# EAGLE design tube timbre trasher 1-9-22-fix (EAGLE 9.6.2)
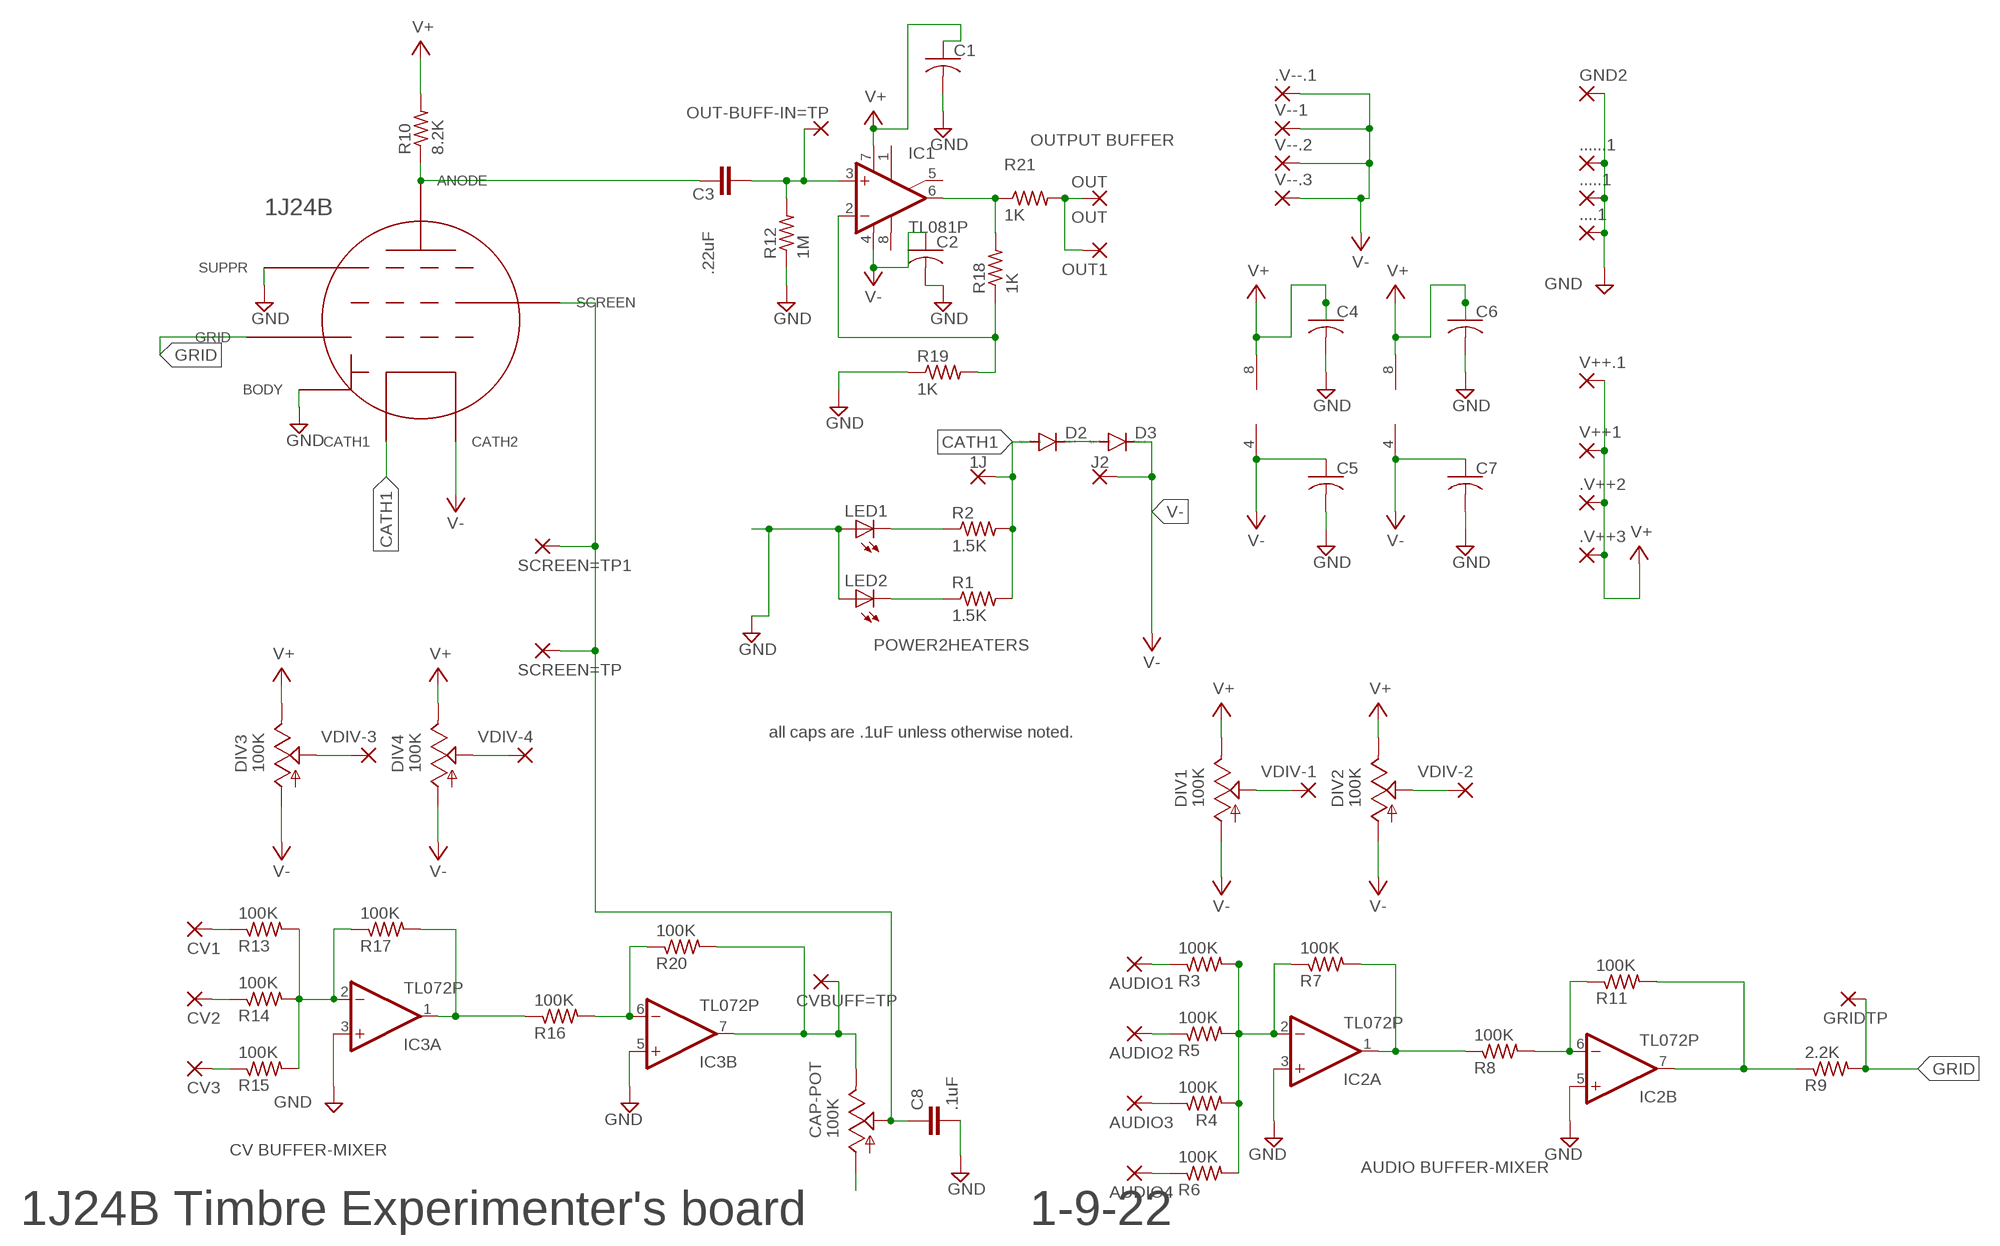
[diagram p0: schematic, sheet 1]

## Parts
1J  1  WIREPAD1,6/0,9  [1,6/0,9]
1J24B  1J24B  [6PINSOLDER]
....1  3,17/1,3  [3,17/1,3]
.....1  3,17/1,3  [3,17/1,3]
......1  3,17/1,3  [3,17/1,3]
.V++2  2,54/1,0  [2,54/1,0]
.V++3  2,54/1,0  [2,54/1,0]
.V--.1  3,17/1,3  [3,17/1,3]
AUDIO1  3,17/1,3  [3,17/1,3]
AUDIO2  3,17/1,3  [3,17/1,3]
AUDIO3  3,17/1,3  [3,17/1,3]
AUDIO4  3,17/1,3  [3,17/1,3]
C1  C-US025-025X050  [C025-025X050]
C2  C-US025-025X050  [C025-025X050]
C3  .22uF  C5/3.5  [C5B3.5]
C4  C-US025-030X050  [C025-030X050]
C5  C-US025-025X050  [C025-025X050]
C6  C-US025-025X050  [C025-025X050]
C7  C-US025-025X050  [C025-025X050]
C8  .1uF  C5/2.5  [C5B2.5]
CAP-POT  100K  9MM_SNAP-IN_POT_  [9MM_SNAP-IN_POT]
CV1  3,17/1,3  [3,17/1,3]
CV2  3,17/1,3  [3,17/1,3]
CV3  3,17/1,3  [3,17/1,3]
CVBUFF=TP  3,17/1,3  [3,17/1,3]
D2  1N4148DO35-7  [DO35-7]
D3  1N4148DO35-7  [DO35-7]
DIV1  100K  9MM_SNAP-IN_POT_  [9MM_SNAP-IN_POT]
DIV2  100K  9MM_SNAP-IN_POT_  [9MM_SNAP-IN_POT]
DIV3  100K  9MM_SNAP-IN_POT_  [9MM_SNAP-IN_POT]
DIV4  100K  9MM_SNAP-IN_POT_  [9MM_SNAP-IN_POT]
GND2  3,17/1,3  [3,17/1,3]
GRIDTP  3,17/1,3  [3,17/1,3]
IC1  TL081P  [DIL08]
IC2  TL072P  [DIL08]
IC3  TL072P  [DIL08]
J2  1  WIREPAD1,6/0,9  [1,6/0,9]
LED1  LED3MM  [LED3MM]
LED2  LED3MM  [LED3MM]
OUT  OUT  3,17/1,3  [3,17/1,3]
OUT1  3,17/1,3  [3,17/1,3]
OUT-BUFF-IN=TP  3,17/1,3  [3,17/1,3]
R1  1.5K  R-US_0207/10  [0207/10]
R2  1.5K  R-US_0207/10  [0207/10]
R3  100K  R-US_0204/7  [0204/7]
R4  100K  R-US_0204/7  [0204/7]
R5  100K  R-US_0204/7  [0204/7]
R6  100K  R-US_0204/7  [0204/7]
R7  100K  R-US_0204/7  [0204/7]
R8  100K  R-US_0204/7  [0204/7]
R9  2.2K  R-US_0204/7  [0204/7]
R10  8.2K  R-US_0207/15  [0207/15]
R11  100K  R-US_0204/7  [0204/7]
R12  1M  R-US_0204/7  [0204/7]
R13  100K  R-US_0204/7  [0204/7]
R14  100K  R-US_0204/7  [0204/7]
R15  100K  R-US_0204/7  [0204/7]
R16  100K  R-US_0204/7  [0204/7]
R17  100K  R-US_0204/7  [0204/7]
R18  1K  R-US_0204/7  [0204/7]
R19  1K  R-US_0204/7  [0204/7]
R20  100K  R-US_0204/7  [0204/7]
R21  1K  R-US_0204/7  [0204/7]
SCREEN=TP  3,17/1,3  [3,17/1,3]
SCREEN=TP1  3,17/1,3  [3,17/1,3]
V++1  2,54/1,0  [2,54/1,0]
V++.1  2,54/1,0  [2,54/1,0]
V--1  3,17/1,3  [3,17/1,3]
V--.2  3,17/1,3  [3,17/1,3]
V--.3  3,17/1,3  [3,17/1,3]
VDIV-1  3,17/1,3  [3,17/1,3]
VDIV-2  3,17/1,3  [3,17/1,3]
VDIV-3  3,17/1,3  [3,17/1,3]
VDIV-4  3,17/1,3  [3,17/1,3]

## Nets
CATH1: 1J24B.1-CATH(CATH1) 1J.1(P) D2.A R1.2 R2.2
GND: 1J24B.3-BDY(BODY) 1J24B.4-SUPP(SUPPR) ....1.1(P) .....1.1(P) ......1.1(P) C1.2 C2.2 C4.2 C5.2 C6.2 C7.2 C8.2 GND2.1(P) IC2.3(A:+IN) IC2.5(B:+IN) IC3.3(A:+IN) IC3.5(B:+IN) LED1.A LED2.A R12.1 R19.1
GRID: 1J24B.6-GRID(GRID) GRIDTP.1(P) R9.2
N$1: 1J24B.A(ANODE) C3.1 R10.1
N$2: C3.2 IC1.3(+IN) OUT-BUFF-IN=TP.1(P) R12.2
N$3: LED2.K(C) R1.1
N$4: IC1.6(OUT) R18.2 R21.1
N$5: LED1.K(C) R2.1
N$6: AUDIO1.1(P) R3.1
N$7: DIV1.2(S) VDIV-1.1(P)
N$8: DIV2.2(S) VDIV-2.1(P)
N$9: D2.C D3.A
N$10: AUDIO3.1(P) R4.1
N$11: IC2.6(B:-IN) R8.2 R11.1
N$12: IC3.6(B:-IN) R16.2 R20.1
N$13: IC2.7(B:OUT) R9.1 R11.2
N$14: AUDIO2.1(P) R5.1
N$15: IC2.2(A:-IN) R3.2 R4.2 R5.2 R6.2 R7.1
N$16: IC2.1(A:OUT) R7.2 R8.1
N$17: CAP-POT.3(E) CVBUFF=TP.1(P) IC3.7(B:OUT) R20.2
N$18: IC1.2(-IN) R18.1 R19.2
N$19: OUT1.1(P) OUT.1(P) R21.2
N$20: CV2.1(P) R14.1
N$21: IC3.2(A:-IN) R13.2 R14.2 R15.2 R17.1
N$22: IC3.1(A:OUT) R16.1 R17.2
N$23: CV1.1(P) R13.1
N$24: DIV3.2(S) VDIV-3.1(P)
N$25: DIV4.2(S) VDIV-4.1(P)
N$26: CV3.1(P) R15.1
N$27: CAP-POT.1(A)
N$28: AUDIO4.1(P) R6.1
TIE: 1J24B.5-SCR(SCREEN) C8.1 CAP-POT.2(S) SCREEN=TP1.1(P) SCREEN=TP.1(P)
V+: .V++2.1(P) .V++3.1(P) C1.1 C4.1 C6.1 DIV1.3(E) DIV2.3(E) DIV3.3(E) DIV4.3(E) IC1.7(V+) IC2.8(P:V+) IC3.8(P:V+) R10.2 V++1.1(P) V++.1.1(P)
V-: 1J24B.2-CATH(CATH2) .V--.1.1(P) C2.1 C5.1 C7.1 D3.C DIV1.1(A) DIV2.1(A) DIV3.1(A) DIV4.1(A) IC1.4(V-) IC2.4(P:V-) IC3.4(P:V-) J2.1(P) V--1.1(P) V--.2.1(P) V--.3.1(P)
Unconnected: IC1.1(ON1) IC1.5(ON2) IC1.8(OPT)

## Notes on the sheet
- OUTPUT BUFFER
- POWER2HEATERS
- all caps are .1uF unless otherwise noted.
- CV BUFFER-MIXER
- AUDIO BUFFER-MIXER
- 1J24B Timbre Experimenter's board | 1-9-22

## Library data of the parts
1J J2 = wirepad:WIREPAD: Wire PAD connect wire on PCB; SPICEPREFIX: X
1J24B = submini tubes CL:1J24B; SPICEPREFIX: X
....1 .....1 ......1 GND2 = wirepad:3,17/1,3: THROUGH-HOLE PAD
.V++2 .V++3 V++1 V++.1 = wirepad-NONAMES:2,54/1,0: THROUGH-HOLE PAD
.V--.1 V--1 V--.2 V--.3 = wirepad-NONAMES:3,17/1,3: THROUGH-HOLE PAD
AUDIO1-AUDIO4 CV1-CV3 CVBUFF=TP GRIDTP OUT OUT1 OUT-BUFF-IN=TP SCREEN=TP SCREEN=TP1 VDIV-1-VDIV-4 = wirepad:3,17/1,3: THROUGH-HOLE PAD; SPICEPREFIX: X
C1 C2 C4-C7 = rcl:C-US: CAPACITOR, American symbol; SPICEPREFIX: C
C3 C8 = capacitor-wima:C: CAPACITOR naming: grid - package width; SPICEPREFIX: C
CAP-POT DIV1-DIV4 = MusicThingModular-CL:9MM_SNAP-IN_POT: 9mm vertical snap-in pot, Alpha / Panasonic style; SPICEPREFIX: J
D2 D3 = diode:1N4148: DIODE high speed (Philips); SPICEPREFIX: D
IC1 = linear:TL081: OP AMP; SPICEPREFIX: X
IC2 IC3 = linear:TL072: OP AMP; SPICEPREFIX: B
LED1 LED2 = adafruit:LED: LED OSRAM: - CHIPLED LG R971, LG N971, LY N971, LG Q971, LY Q971, LO R971, LY R971 LH N974, LH R974 LS Q976, LO Q976, LY Q976 LO Q996 - Hyper CHIPLED LW Q18S LB Q993, LB Q99A, LB R99A - SideLED LS A670, LO A670, LY A670, LG A670, LP A670 LB A673, LV A673, LT A673, LW A673 LH A674 LY A675 LS A676, LA A676, LO A676, LY A676, LW A676 LS A679, LY A679, LG A679 - Hyper Micro SIDELED® LS Y876, LA Y876, LO Y876, LY Y876 LT Y87S - SmartLED LW L88C, LW L88S LB L89C, LB L89S, LG L890 LS L89K, LO L89K, LY L89K LS L896, LA L896, LO L896, LY L896 - TOPLED LS T670, LO T670, LY T670, LG T670, LP T670 LSG T670, LSP T670, LSY T670, LOP T670, LYG T670 LG T671, LOG T671, LSG T671 LB T673, LV T673, LT T673, LW T673 LH T674 LS T676, LA T676, LO T676, LY T676, LB T676, LH T676, LSB T676, LW T676 LB T67C, LV T67C, LT T67C, LS T67K, LO T67K, LY T67K, LW E67C LS E67B, LA E67B, LO E67B, LY E67B, LB E67C, LV E67C, LT E67C LW T67C LS T679, LY T679, LG T679 LS T770, LO T770, LY T770, LG T770, LP T770 LB T773, LV T773, LT T773, LW T773 LH T774 LS E675, LA E675, LY E675, LS T675 LS T776, LA T776, LO T776, LY T776, LB T776 LHGB T686 LT T68C, LB T68C - Hyper Mini TOPLED® LB M676 - Mini TOPLED Santana® LG M470 LS M47K, LO M47K, LY M47K Source: http://www.osram.convergy.de/; SPICEPREFIX: L
R1 R2 = resistor:R-US_: RESISTOR, American symbol; SPICEPREFIX: R
R3-R21 = rcl:R-US_: RESISTOR, American symbol; SPICEPREFIX: R

## Board
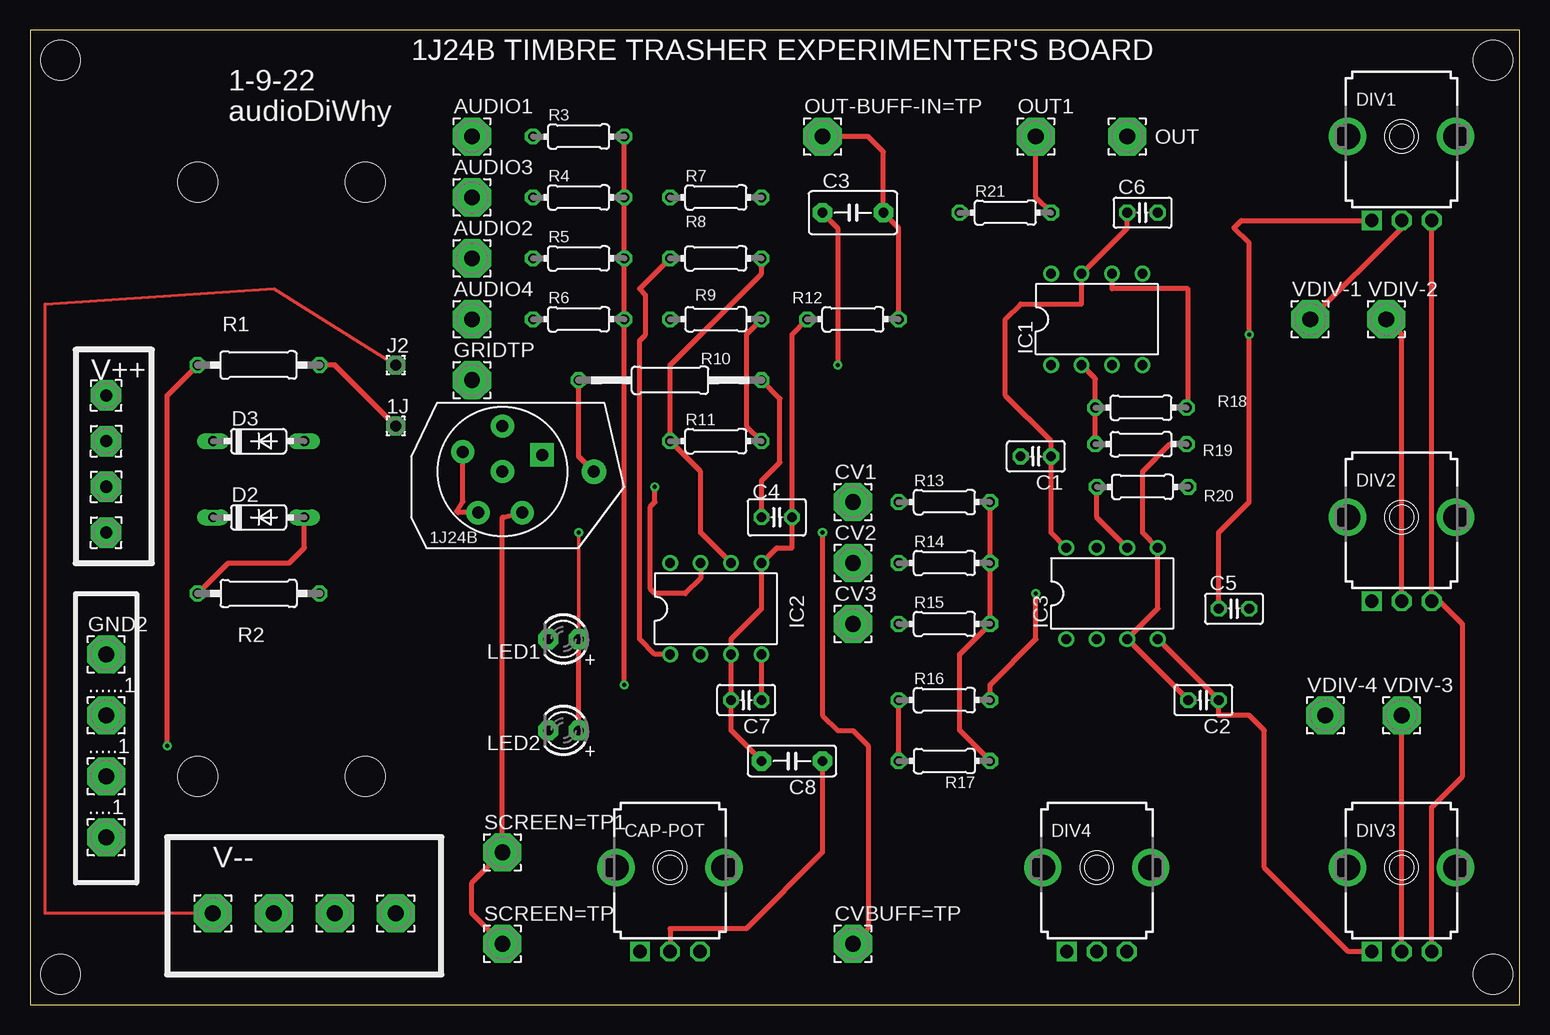
[diagram p1: board, top side]
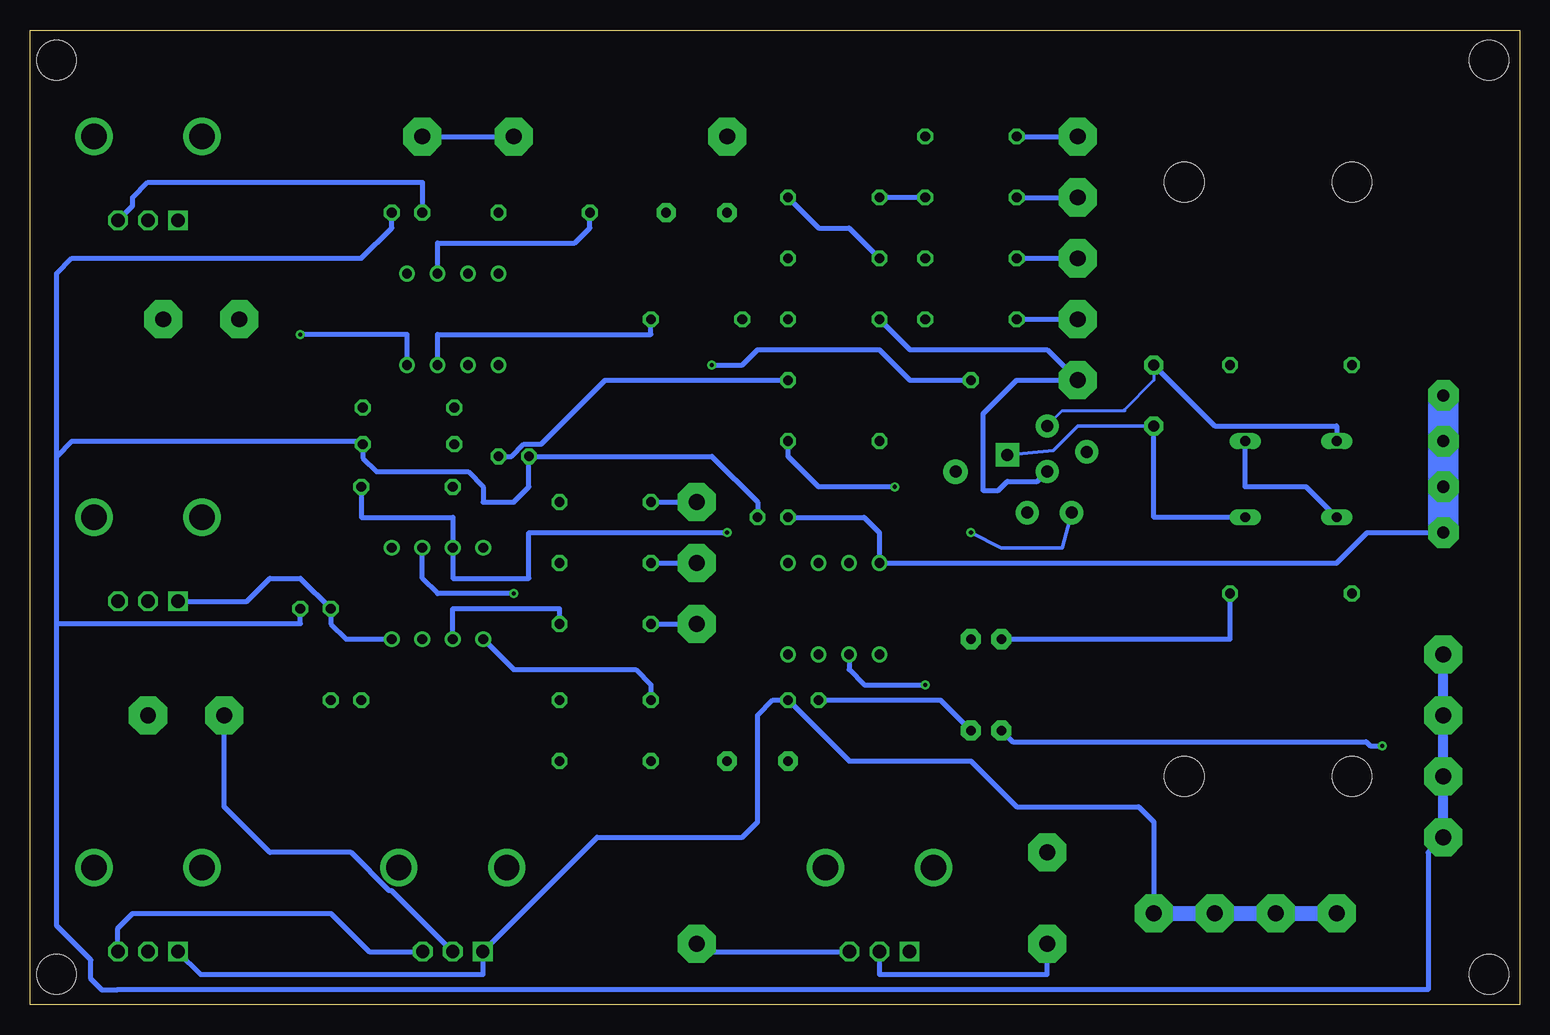
[diagram p2: board, bottom side, seen from below]

Size 124.13 x 81.27 mm. Coordinates in mm from the lower left corner, seen from the top.
Outline: 0,0 124.13,0 124.13,81.27 0,81.27 0,0
Copper layers (1*16): Top 0.035mm / dielectric 1.5mm / Bottom 0.035mm
Design rules "default": minimum track width 6mil, minimum drill 0.35mm, track to track 6mil, track to pad 6mil, pad to pad 6mil, via to via 6mil, smd to smd 6mil, copper to edge 40mil, drill to drill 6mil, minimum pad ring 10mil, minimum via ring 8mil, stop-mask expansion 4mil, vias tented up to drill 0mil, thermal gap 10mil
Holes 3.3 mm at 2.54,78.74 121.92,78.74 121.92,2.54 2.54,2.54 13.97,19.05 27.94,19.05 13.97,68.58 27.94,68.58

### Footprints (pad centres in the part's own frame; a part is rotated, then mirrored left to right if it is on the bottom)
1,6/0,9 = drill 0.914 pad 1.6 octagon: 1 0,0
6PINSOLDER = drill 1 pad 1.93 square: 1-CATH 5.842,2.667 | drill 1 pad 1.93: 2-CATH 2.54,5.08; 3-BDY -0.762,2.921; 4-SUPP 0.508,-2.159; 5-SCR 4.191,-2.159; 6-GRID 2.54,1.27 | drill 1.016 pad 2.032: A 10.16,1.27
3,17/1,3 = drill 1.321 pad 3.175 octagon: 1 0,0
2,54/1,0 = drill 1.016 pad 2.54 octagon: 1 0,0
C025-025X050 = drill 0.813 octagon: 1 -1.27,0; 2 1.27,0
C5B3.5 = drill 0.813 pad 1.6 octagon: 1 -2.54,0; 2 2.54,0
C025-030X050 = drill 0.813 octagon: 1 -1.27,0; 2 1.27,0
C5B2.5 = drill 0.813 pad 1.6 octagon: 1 -2.54,0; 2 2.54,0
9MM_SNAP-IN_POT = drill 1.1 square: 1 -2.5,-7 | drill 1.1 octagon: 2 0,-7; 3 2.5,-7 | drill 2.1 pad 2.794: CHASSIS1 -4.5,0; CHASSIS2 4.5,0
DO35-7 = drill 0.813 long: A 3.81,0; C -3.81,0
DIL08 = drill 0.813 pad 1.27: 1 -3.81,-3.81; 2 -1.27,-3.81; 3 1.27,-3.81; 4 3.81,-3.81; 5 3.81,3.81; 6 1.27,3.81; 7 -1.27,3.81; 8 -3.81,3.81
LED3MM = drill 0.813 pad 1.676 octagon: A -1.27,0; K 1.27,0
0207/10 = drill 0.813 octagon: 1 -5.08,0; 2 5.08,0
0204/7 = drill 0.813 octagon: 1 -3.81,0; 2 3.81,0
0207/15 = drill 0.813 octagon: 1 -7.62,0; 2 7.62,0

### Placement (x,y rotation side)
1J  30.48,48.26 0 top
1J24B  36.83,43.18 0 top
....1  6.35,13.97 0 top
.....1  6.35,19.05 0 top
......1  6.35,24.13 0 top
.V++2  6.35,46.99 0 top
.V++3  6.35,39.37 0 top
.V--.1  15.24,7.62 0 top
AUDIO1  36.83,72.39 0 top
AUDIO2  36.83,62.23 0 top
AUDIO3  36.83,67.31 0 top
AUDIO4  36.83,57.15 0 top
C1  83.82,45.72 180 top
C2  97.79,25.4 180 top
C3  68.58,66.04 0 top
C4  62.23,40.64 0 top
C5  100.33,33.02 0 top
C6  92.71,66.04 0 top
C7  59.69,25.4 180 top
C8  63.5,20.32 180 top
CAP-POT  53.34,11.43 0 top
CV1  68.58,41.91 0 top
CV2  68.58,36.83 0 top
CV3  68.58,31.75 0 top
CVBUFF=TP  68.58,5.08 0 top
D2  19.05,40.64 0 top
D3  19.05,46.99 0 top
DIV1  114.3,72.39 0 top
DIV2  114.3,40.64 0 top
DIV3  114.3,11.43 0 top
DIV4  88.9,11.43 0 top
GND2  6.35,29.21 0 top
GRIDTP  36.83,52.07 0 top
IC1  88.9,57.15 0 top
IC2  57.15,33.02 0 top
IC3  90.17,34.29 0 top
J2  30.48,53.34 0 top
LED1  44.45,30.48 180 top
LED2  44.45,22.86 180 top
OUT  91.44,72.39 0 top
OUT1  83.82,72.39 0 top
OUT-BUFF-IN=TP  66.04,72.39 0 top
R1  19.05,53.34 0 top
R2  19.05,34.29 180 top
R3  45.72,72.39 0 top
R4  45.72,67.31 0 top
R5  45.72,62.23 0 top
R6  45.72,57.15 0 top
R7  57.15,67.31 0 top
R8  57.15,62.23 0 top
R9  57.15,57.15 180 top
R10  53.34,52.07 0 top
R11  57.15,46.99 0 top
R12  68.58,57.15 0 top
R13  76.2,41.91 0 top
R14  76.2,36.83 0 top
R15  76.2,31.75 0 top
R16  76.2,25.4 0 top
R17  76.2,20.32 180 top
R18  92.58,49.78 0 top
R19  92.58,46.74 180 top
R20  92.71,43.18 0 top
R21  81.28,66.04 0 top
SCREEN=TP  39.37,5.08 0 top
SCREEN=TP1  39.37,12.7 0 top
V++1  6.35,50.8 0 top
V++.1  6.35,43.18 0 top
V--1  30.48,7.62 0 top
V--.2  20.32,7.62 0 top
V--.3  25.4,7.62 0 top
VDIV-1  106.68,57.15 0 top
VDIV-2  113.03,57.15 0 top
VDIV-3  114.3,24.13 0 top
VDIV-4  107.95,24.13 0 top

### Tracks (layer width: path | path; a pad name or v marks a point on that pad's centre or on a via)
CATH1
  Top 0.406: 1J.1 25.4,53.34 R1.2 | R2.2 16.51,36.83 21.59,36.83 22.86,38.1 D2.A
  Bottom 0.305: 1J.1 36.83,48.26 38.86,46.23 1J24B.1-CATH
  Bottom 0.406: D2.A 30.48,40.64 1J.1
GND  (via drill 0.35)
  Top 0.305: LED1.A v45.72,39.37
  Top 0.406: 1J24B.3-BDY 36.07,41.95 35.56,41.15 35.69,41.02 1J24B.4-SUPP | LED2.A LED1.A | C8.2 58.42,22.86 C7.2 IC2.3 58.42,30.48 60.96,33.02 IC2.5 62.23,38.1 63.5,38.1 C4.2 63.5,55.88 R12.1 | R19.1 95,46.74 92.71,44.45 92.71,39.37 IC3.5 93.98,33.02 IC3.3 C2.2
  Bottom 0.305: v45.72,39.37 43.18,38.1 38.1,38.1 1J24B.4-SUPP
  Bottom 0.406: LED2.A 48.26,25.4 C7.2 | ....1.1 7.62,12.7 7.62,1.27 116.84,1.27 116.89,1.22 118.11,1.22 119.05,2.16 119.05,3.73 121.92,6.6 121.92,31.75 | 121.92,31.75 101.6,31.75 C5.2 | 121.92,31.75 121.92,45.72 | 121.92,45.72 120.65,46.99 96.65,46.99 R19.1 96.39,45.59 95.25,44.45 87.63,44.45 86.36,43.18 86.36,41.91 83.82,41.91 82.55,43.18 C1.2 67.31,45.72 63.5,41.91 C4.2 | 121.92,45.72 121.92,60.96 120.65,62.23 96.52,62.23 93.98,64.77 C6.2
  Bottom 0.813: ....1.1 .....1.1 ......1.1 GND2.1
GRID
  Bottom 0.406: R9.2 50.8,54.61 39.37,54.61 GRIDTP.1 41.91,52.07 44.7,49.28 44.7,42.88 43.43,42.88 42.67,43.64 40.18,43.64 1J24B.6-GRID
N$1  (via drill 0.35)
  Top 0.406: 1J24B.A 45.72,45.72 R10.1 | C3.1 67.31,64.77 v67.31,53.34
  Bottom 0.406: v67.31,53.34 64.77,53.34 63.5,54.61 53.34,54.61 50.8,52.07 R10.1
N$2
  Top 0.406: R12.2 72.39,64.77 C3.2 71.12,71.12 69.85,72.39 OUT-BUFF-IN=TP.1
  Bottom 0.406: IC1.3 90.17,55.88 72.39,55.88 R12.2
N$3  (via drill 0.35)
  Top 0.406: v11.43,21.59 11.43,50.8 R1.1
  Bottom 0.406: v11.43,21.59 12.45,21.59 12.78,21.92 42.24,21.92 LED2.K
N$4
  Top 0.406: R18.2 96.52,49.91 96.52,59.69 90.17,59.69 IC1.6
  Bottom 0.406: IC1.6 90.17,63.5 78.74,63.5 77.47,64.77 R21.1
N$5
  Bottom 0.406: LED1.K 24.13,30.48 R2.1
N$6
  Bottom 0.406: R3.1 AUDIO1.1
N$7
  Top 0.406: VDIV-1.1 114.3,64.77 DIV1.2
N$8
  Top 0.406: DIV2.2 114.3,55.88 VDIV-2.1
N$9
  Bottom 0.406: D2.C 17.78,43.18 22.86,43.18 D3.A
N$10
  Bottom 0.406: R4.1 AUDIO3.1
N$11
  Top 0.406: R8.2 60.96,60.96 53.34,53.34 R11.1 55.88,44.45 55.88,39.37 IC2.6
N$12  (via drill 0.35)
  Top 0.406: R16.2 80.01,26.67 83.82,30.48 v83.82,34.29 | IC3.6 88.9,40.64 R20.1
  Bottom 0.406: v83.82,34.29 90.17,34.29 91.44,35.56 IC3.6
N$13  (via drill 0.35)
  Top 0.406: IC2.7 55.88,35.56 54.61,34.29 52.07,34.29 51.69,34.67 51.69,41.53 52.07,41.91 v52.07,43.18 | R9.1 59.69,55.88 59.69,48.26 R11.2
  Bottom 0.406: v52.07,43.18 58.42,43.18 60.96,45.72 R11.2
N$14
  Bottom 0.406: R5.1 AUDIO2.1
N$15  (via drill 0.35)
  Top 0.406: R3.2 R4.2 R5.2 R6.2 v49.53,26.67
  Bottom 0.406: R4.2 R7.1 | IC2.2 55.88,27.94 54.61,26.67 v49.53,26.67
N$16
  Top 0.406: IC2.1 52.07,29.21 50.8,30.48 50.8,55.37 51.31,55.88 51.31,59.18 50.8,59.69 R8.1
  Bottom 0.406: R7.2 58.42,64.77 55.88,64.77 R8.1
N$17  (via drill 0.35)
  Top 0.406: v66.04,39.37 66.04,24.13 67.31,22.86 68.58,22.86 69.85,21.59 69.85,6.35 CVBUFF=TP.1
  Bottom 0.406: CVBUFF=TP.1 67.93,4.43 CAP-POT.3 | R20.2 96.52,40.64 88.9,40.64 IC3.7 88.9,35.56 82.55,35.56 82.55,39.37 v66.04,39.37
N$18
  Top 0.406: R19.2 R18.1 88.77,52.2 IC1.2
N$19
  Top 0.406: R21.2 83.82,67.31 OUT1.1
  Bottom 0.406: OUT.1 OUT1.1
N$20
  Bottom 0.406: R14.1 CV2.1
N$21
  Top 0.406: R17.1 77.47,22.86 77.47,29.21 R15.2 R14.2 R13.2
  Bottom 0.406: IC3.2 88.9,33.02 80.01,33.02 R15.2
N$22
  Top 0.406: R17.2 R16.1
  Bottom 0.406: IC3.1 83.82,27.94 73.66,27.94 72.39,26.67 R16.1
N$23
  Bottom 0.406: R13.1 CV1.1
N$24
  Top 0.406: DIV3.2 VDIV-3.1
N$25
  Bottom 0.406: DIV4.2 93.99,9.52 94.19,9.52 97.38,12.7 104.14,12.7 107.95,16.51 VDIV-4.1
N$26
  Bottom 0.406: R15.1 CV3.1
N$28
  Bottom 0.406: R6.1 AUDIO4.1
TIE
  Top 0.406: SCREEN=TP.1 36.83,7.62 36.83,10.16 SCREEN=TP1.1 39.37,40.64 1J24B.5-SCR | C8.1 66.04,12.7 59.69,6.35 53.34,6.35 CAP-POT.2
  Bottom 0.406: CAP-POT.2 53.34,2.54 39.37,2.54 SCREEN=TP.1
V+
  Top 0.406: C4.1 60.96,43.69 62.48,45.21 62.48,50.55 R10.2 | IC3.8 85.09,39.37 C1.1 85.09,46.99 81.28,50.8 81.28,57.15 82.55,58.42 87.63,58.42 IC1.7 91.44,64.77 C6.1 | DIV2.3 116.8,34.29 | 116.8,34.29 DIV1.3 | DIV3.3 116.8,16.47 119.38,19.05 119.38,31.71 116.8,34.29
  Bottom 0.406: .V++3.1 12.7,39.37 15.24,36.83 IC2.8 53.34,39.37 54.61,40.64 C4.1 | DIV1.3 115.57,66.62 115.57,67.31 114.3,68.58 91.44,68.58 C6.1 | DIV3.3 116.8,6.39 115.57,7.62 99.06,7.62 95.87,4.43 DIV4.3 | C1.1 83.99,45.72 82.97,46.74 81.53,46.74 76.2,52.07 R10.2
  Bottom 2.54: V++1.1 .V++2.1 V++.1.1 .V++3.1
V-  (via drill 0.35)
  Top 0.254: .V--.1.1 1.27,7.62 1.27,58.42 20.32,59.69 J2.1
  Top 0.406: C7.1 IC2.4 | DIV1.1 100.95,65.39 100.33,64.77 101.6,63.5 v101.6,55.88 101.6,41.91 99.06,39.37 C5.1 | DIV3.1 109.87,4.43 102.87,11.43 102.87,22.86 101.6,24.13 99.06,24.13 C2.1 IC3.4
  Bottom 0.254: J2.1 30.48,52.07 32.95,49.6 32.89,49.53 38.1,49.53 1J24B.2-CATH
  Bottom 0.406: V--1.1 30.48,15.24 31.75,16.51 41.91,16.51 45.72,20.32 55.88,20.32 C7.1 62.23,25.4 63.5,24.13 63.5,15.24 64.77,13.97 76.86,13.97 DIV4.1 86.36,4.39 86.36,2.54 109.91,2.54 DIV3.1 | DIV2.1 106.06,33.64 104.14,35.56 101.6,35.56 C5.1 99.06,31.75 97.79,30.48 IC3.4 | IC1.4 92.71,55.88 v101.6,55.88 | J2.1 25.4,48.26 15.24,48.26 D3.C
  Bottom 1.27: V--1.1 V--.3.1 V--.2.1 .V--.1.1

### Text on the board
tNames: 1J24B TIMBRE TRASHER EXPERIMENTER'S BOARD | 1-9-22 | audioDiWhy | V++ | V--
tValues: V-